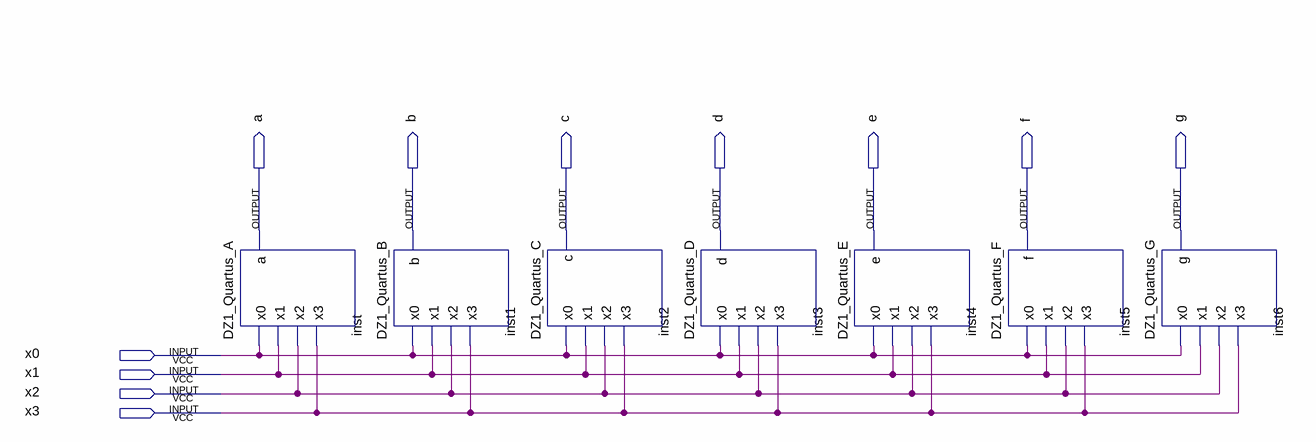
[diagram p0: schematic sheet]
// Quartus schematic BCD.bdf as structural Verilog: 7 symbols, 11 pins
module BCD (
  input  x0,
  input  x1,
  input  x2,
  input  x3,
  output a,
  output b,
  output c,
  output d,
  output e,
  output f,
  output g
);

  DZ1_Quartus_A inst (.x0(x0), .x1(x1), .x2(x2), .x3(x3), .a(a));
  DZ1_Quartus_B inst1 (.x0(x0), .x1(x1), .x2(x2), .x3(x3), .b(b));
  DZ1_Quartus_C inst2 (.x0(x0), .x1(x1), .x2(x2), .x3(x3), .c(c));
  DZ1_Quartus_D inst3 (.x0(x0), .x1(x1), .x2(x2), .x3(x3), .d(d));
  DZ1_Quartus_E inst4 (.x0(x0), .x1(x1), .x2(x2), .x3(x3), .e(e));
  DZ1_Quartus_F inst5 (.x0(x0), .x1(x1), .x2(x2), .x3(x3), .f(f));
  DZ1_Quartus_G inst6 (.x0(x0), .x1(x1), .x2(x2), .x3(x3), .g(g));
endmodule
